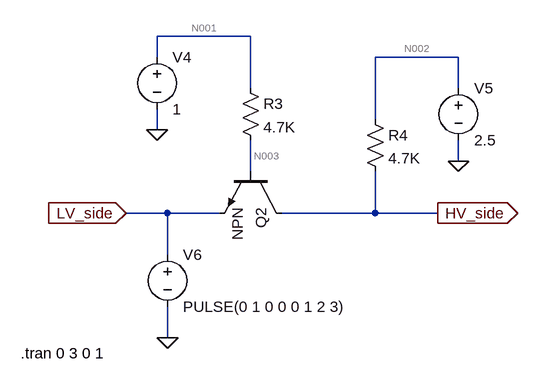
[diagram p0: schematic ip_at_LV_side.asc]
ip_at_LV_side.asc, the LTspice schematic file:
Version 4
SHEET 1 1132 840
WIRE 512 336 368 336
WIRE 368 368 368 336
WIRE 832 368 704 368
WIRE 512 416 512 336
WIRE 832 416 832 368
WIRE 704 464 704 368
WIRE 368 480 368 448
WIRE 832 528 832 496
WIRE 512 544 512 496
WIRE 384 608 320 608
WIRE 464 608 384 608
WIRE 704 608 704 544
WIRE 704 608 560 608
WIRE 800 608 704 608
WIRE 384 672 384 608
WIRE 384 800 384 752
FLAG 368 480 0
FLAG 832 528 0
FLAG 320 608 LV_side
IOPIN 320 608 In
FLAG 800 608 HV_side
IOPIN 800 608 Out
FLAG 384 800 0
SYMBOL npn 560 544 R90
SYMATTR InstName Q2
SYMBOL res 496 400 R0
SYMATTR InstName R3
SYMATTR Value 4.7K
SYMBOL res 688 448 R0
SYMATTR InstName R4
SYMATTR Value 4.7K
SYMBOL voltage 368 352 R0
SYMATTR InstName V4
SYMATTR Value 1
SYMBOL voltage 832 400 R0
SYMATTR InstName V5
SYMATTR Value 2.5
SYMBOL voltage 384 656 R0
SYMATTR InstName V6
SYMATTR Value PULSE(0 1 0 0 0 1 2 3)
TEXT 158 824 Left 2 !.tran 0 3 0 1

The netlist it stands for:
* ip_at_LV_side.asc
Q2 HV_side N003 LV_side 0 NPN
R3 N001 N003 4.7K
R4 N002 HV_side 4.7K
V4 N001 0 1
V5 N002 0 2.5
V6 LV_side 0 PULSE(0 1 0 0 0 1 2 3)
.model NPN NPN
.model PNP PNP
.lib standard.bjt
.tran 0 3 0 1
.backanno
.end

* Results of the author's LTspice run, read from the files saved beside the schematic
* Operating Point, zero values left out:
*   V(hv_side) = 67.46 mV
*   V(n003) = 761.3 mV
*   V(n001) = 1 V
*   V(n002) = 2.5 V
*   Ic(Q2) = 517.6 µA
*   Ib(Q2) = 50.78 µA
*   Ie(Q2) = -568.3 µA
*   I(R4) = 517.6 µA
*   I(R3) = 50.78 µA
*   I(V6) = 568.3 µA
*   I(V5) = -517.6 µA
*   I(V4) = -50.78 µA
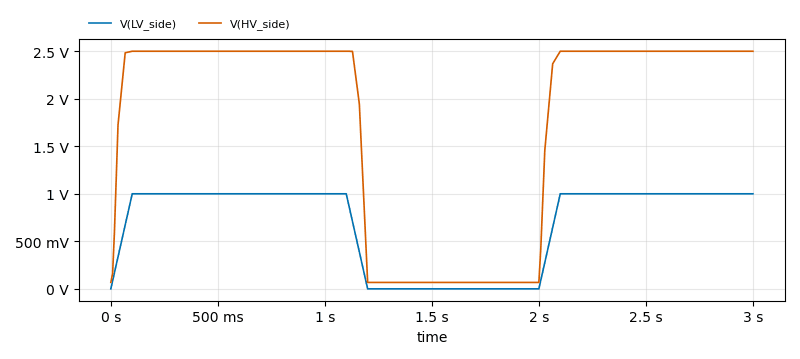
[diagram p1: Transient Analysis of ip_at_LV_side.asc, plotted from the saved traces]
* Transient Analysis, 1 run:
*   V(LV_side): min 0 V, max 1 V, average 683.3 mV, rms 817.4 mV, last 1 V
*   V(HV_side): min 67.46 mV, max 2.5 V, average 1.78 V, rms 2.086 V, last 2.5 V